# EasyEDA Pro project coildriver.eprj, board PCB2
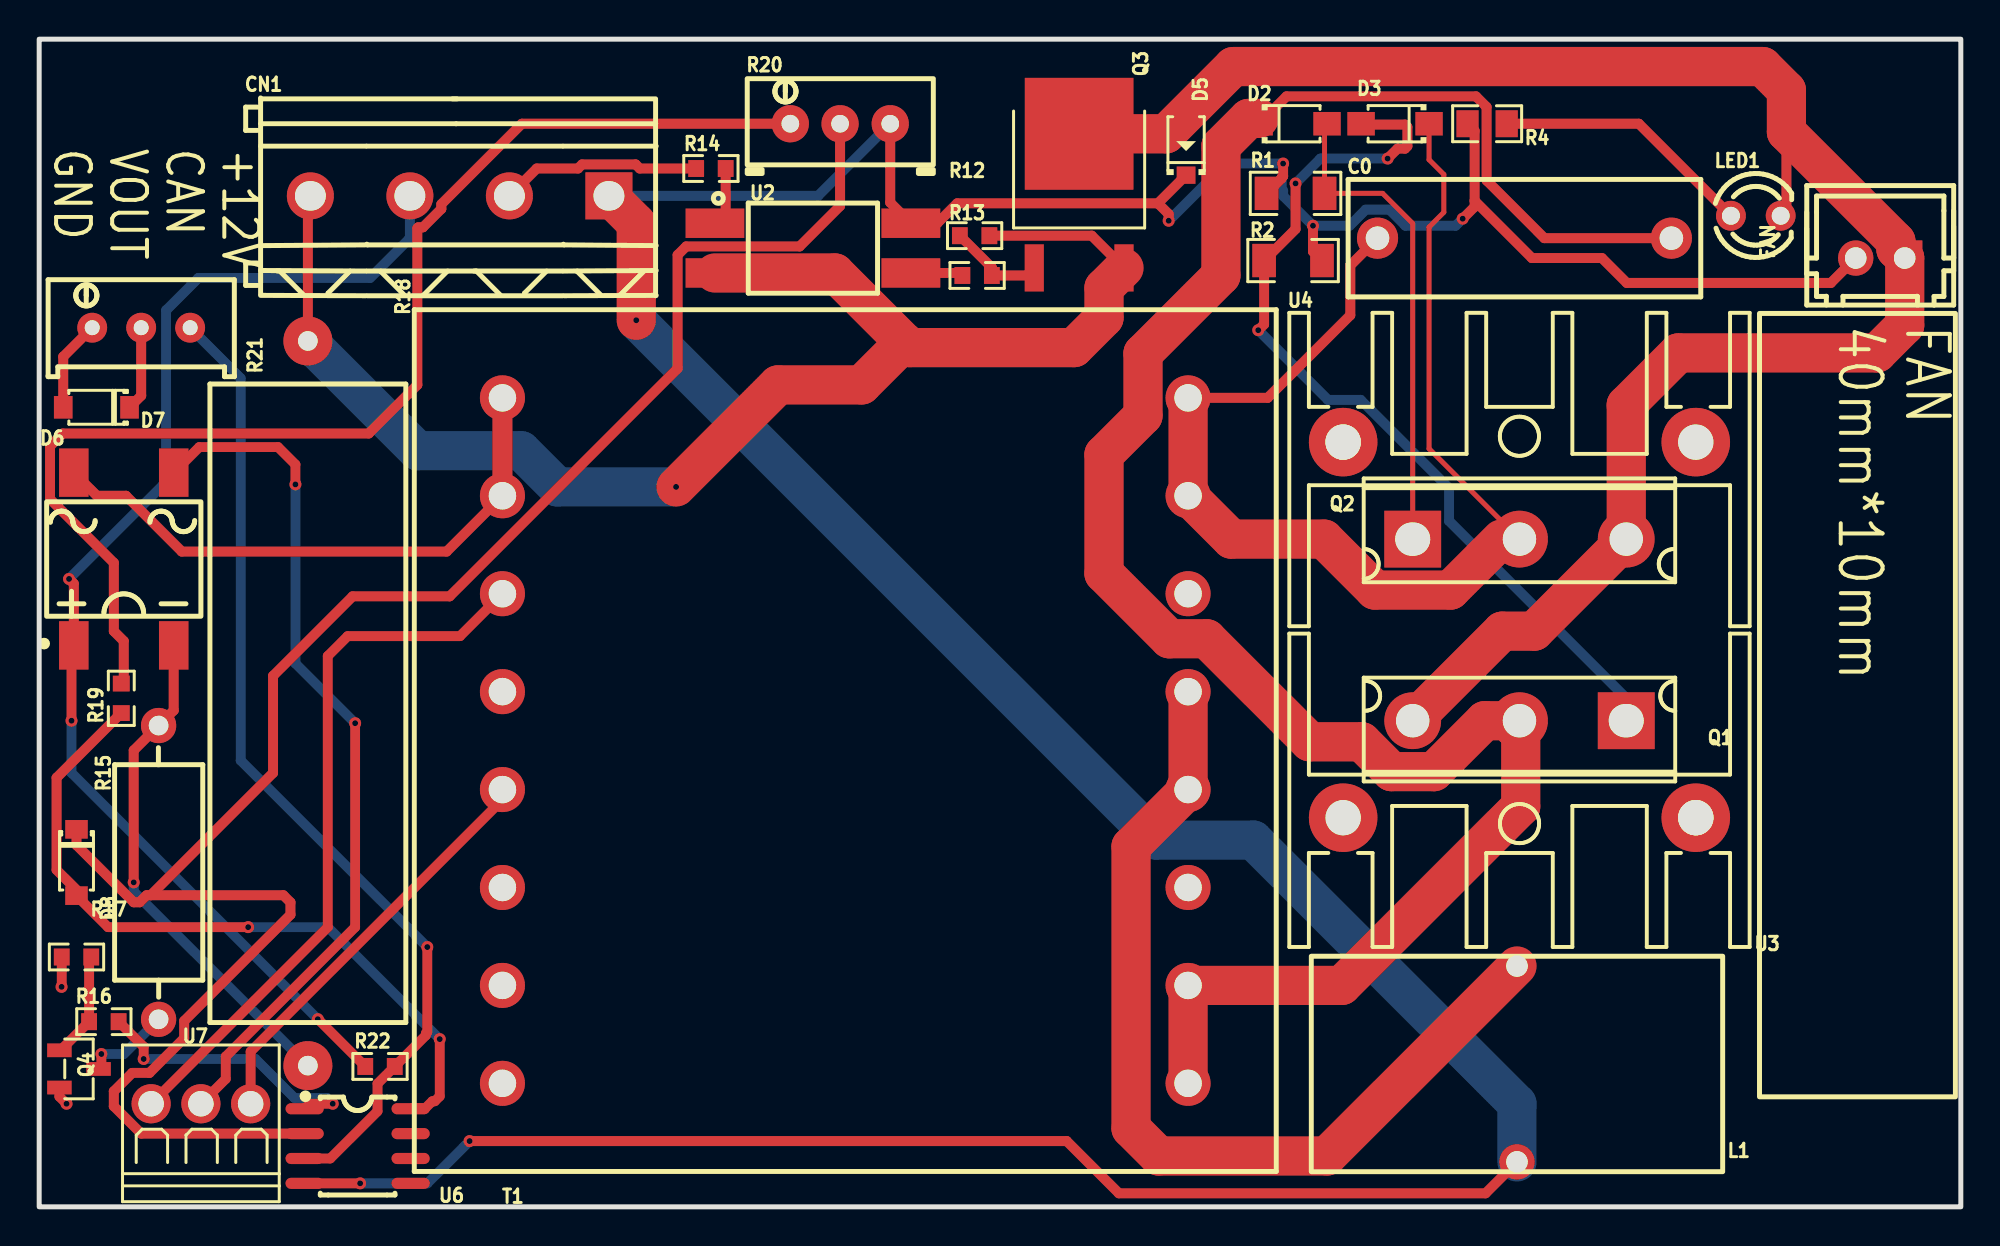
[diagram p4: board, top side]
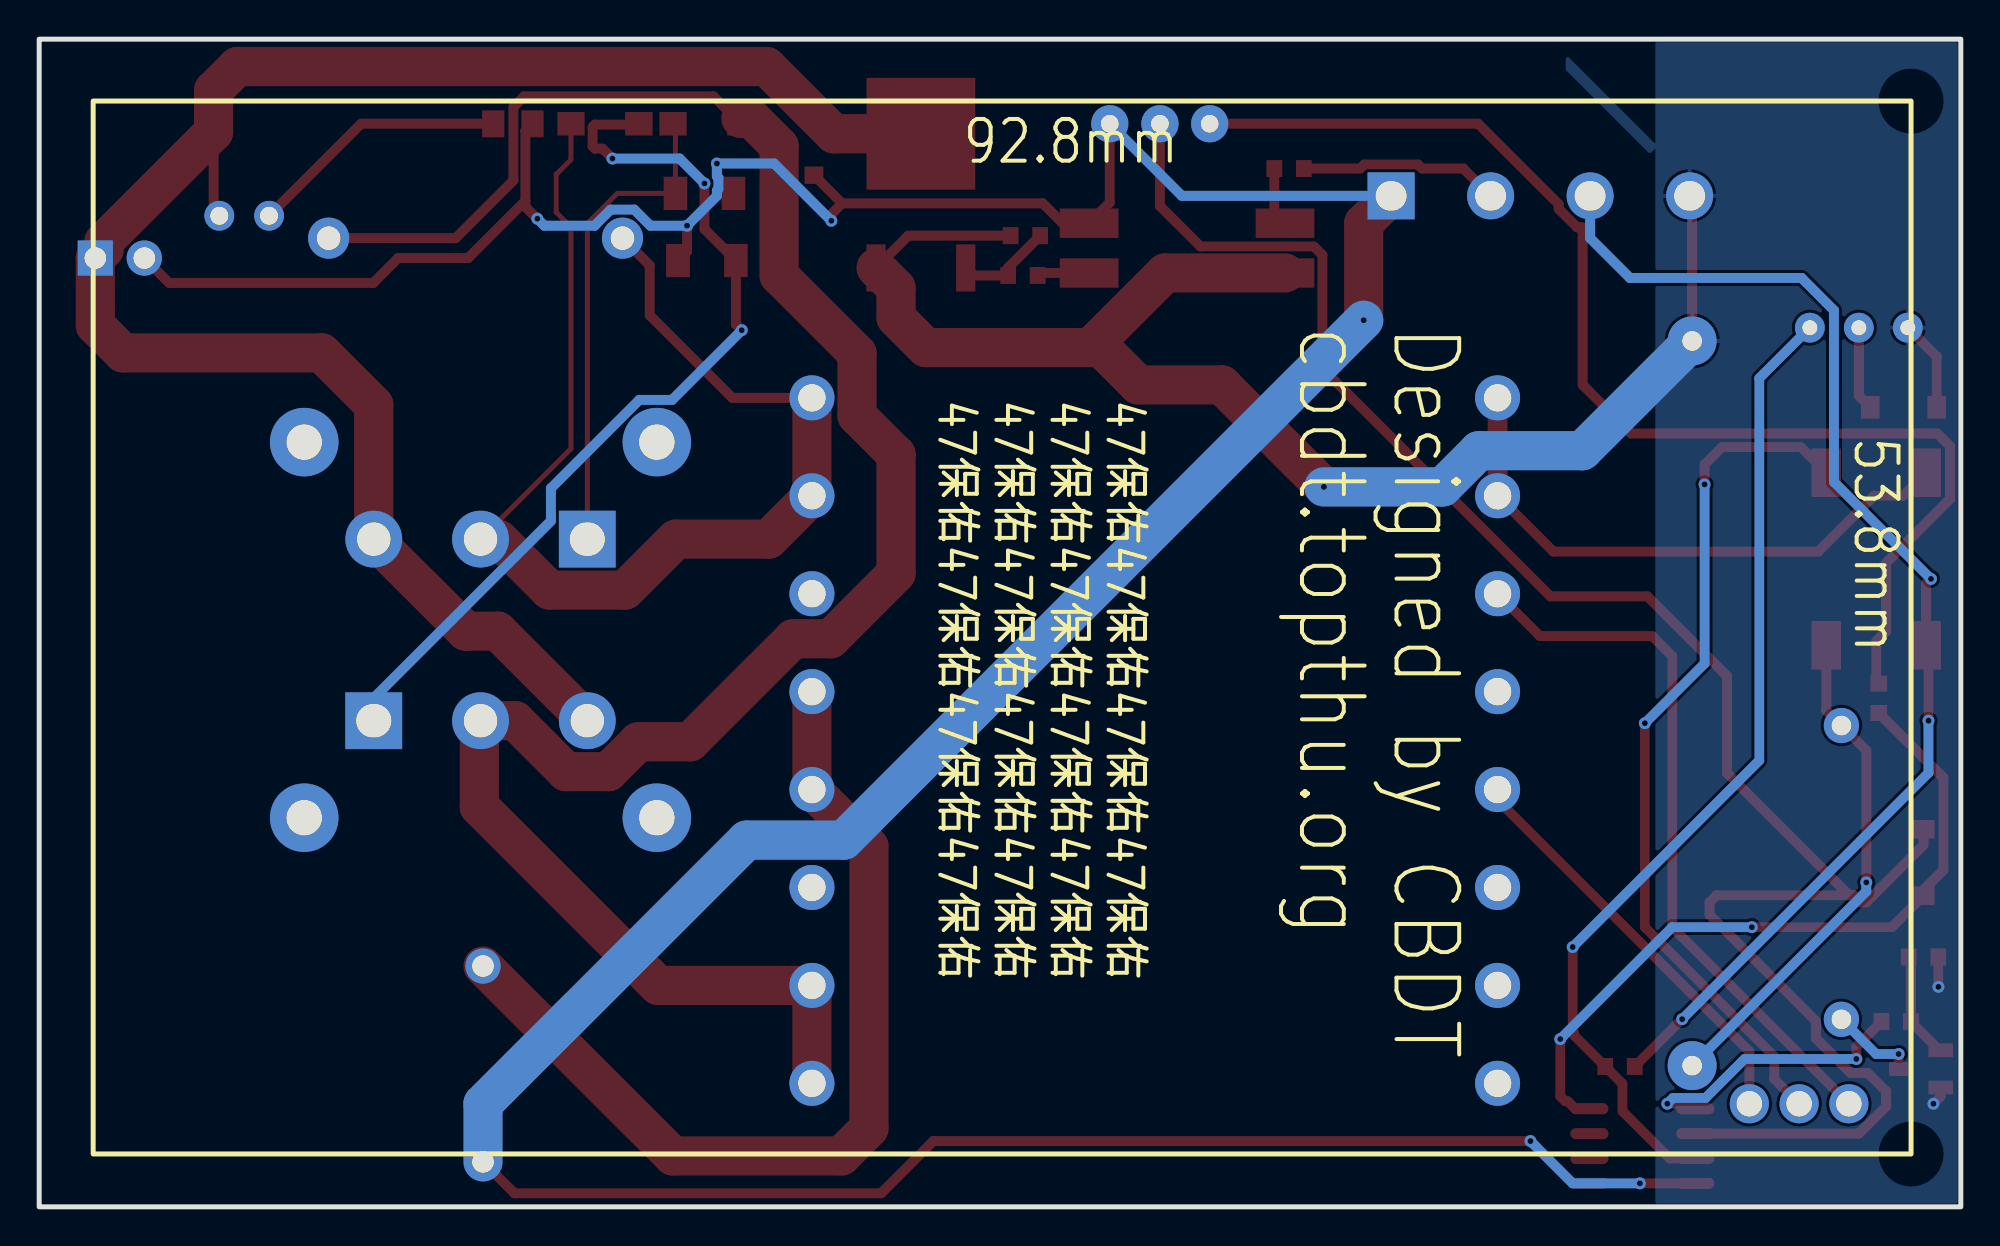
[diagram p5: board, bottom side, seen from below]

Outline 98.09 x 59.62 mm; copper layers: Top Layer, Bottom Layer. Coordinates in mm from the lower left corner of the outline.
Outline path: rectangle 0,59.62 98.09,0
Stack: Top Layer 0.035mm / Dielectric1 1.51mm FR4 er 4.5 / Bottom Layer 0.035mm

## Design rules (mm)
template: 自定义配置
spacing copperThickness1oz (default): track to track 0.102, other pairs 0.152 to 0.3
spacing copperThickness2oz: track to track 0.203, other pairs 0.152 to 0.3
track width copperThickness1oz (default): min 0.127, default 2, max 2.54
track width copperThickness2oz: min 0.203, default 0.254, max 2.54
differential pair differentialPair (default): width min 0.127, default 0.254, max 2.54; gap min 0.152, default 0.152
via viaSize (default): diameter min 0.5, default 0.61, max 10; hole min 0.3, default 0.305, max 6.3

## Placement (name value [footprint] x y rotation side)
C0  330nF  [CAP-TH_L18.0-W6.0-P15.00-D0.8]  75.82 49.46 0 top
CN1  DB128L-5.08-4P-GN-S  [CONN-TH_4P_DB128L-5.08-4P-GN-S]  21.46 51.62 0 top
D2  FR107  [SOD-123FL_L2.7-W1.8-LS3.8-RD]  64.01 55.3 0 top
D3  FR107  [SOD-123FL_L2.7-W1.8-LS3.8-RD]  69.22 55.3 180 top
D5  1N4148W  [SOD-123_L2.7-W1.6-LS3.7-FD]  58.55 54.29 270 top
D6  DB107S  [DBS_L8.2-W6.4-P5.10-LS10.0-BL]  4.32 33.08 0 top
D7  MM1Z5V1  [SOD-123_L2.8-W1.8-LS3.7-RD]  2.92 40.82 180 top
D8  MM1Z5V1  [SOD-123_L2.8-W1.8-LS3.7-RD]  1.91 17.58 270 top
FAN  ZX-XH2.54-2PZZ  [CONN-TH_2P-P2.50_HX25003-2A]  93.98 48.44 180 top
L1  68uH  [IND-TH_L21.0-W11.0-P10.00]  75.44 7.3 90 top
LED1  MV7442/QT264-7UGC  [LED-TH_BD3.0-P2.54-FD]  87.63 50.6 0 top
Q1  IRFP250NPBF  [TO-247AC-3_L15.8-W5.0-P5.46-L]  75.56 24.82 180 top
Q2  IRFP250NPBF  [TO-247AC-3_L15.8-W5.0-P5.46-L]  75.56 34.09 0 top
Q3  LR7843-VB  [TO-252-2_L6.6-W6.1-P4.58-LS9.9-BR]  53.09 51.36 270 top
Q4  AO3400A  [SOT-23-3_L2.9-W1.3-P1.90-LS2.4-BR]  2.03 7.04 180 top
R1  470Ω  [R1206]  64.13 51.75 0 top
R2  470Ω  [R1206]  64.01 48.32 180 top
R4  400Ω  [R0805]  73.91 55.3 180 top
R12  1kΩ  [R0603]  47.88 47.55 0 top
R13  10kΩ  [R0603]  47.75 49.59 180 top
R14  1kΩ  [R0603]  34.29 53.02 0 top
R15  20Ω  [RES-TH_BD4.5-L11.0-P15.00-D0.7]  6.1 17.07 90 top
R16  1kΩ  [R0603]  3.3 9.45 180 top
R17  10kΩ  [R0603]  1.91 12.76 0 top
R18  500Ω  [RES-TH_BD9.0-L31.5-P35.50-D0.8]  13.72 25.71 270 top
R19  47kΩ  [R0603]  4.19 25.96 90 top
R20  100kΩ  [RES-ADJ-TH_3P-L9.5-W4.9-P2.50-L_3296W]  40.89 55.3 0 top
R21  20kΩ  [RES-ADJ-TH_3P-L10.0-W10.0-P2.50-BL-BS]  5.21 44.89 90 top
R22  100kΩ  [R0603]  17.4 7.17 180 top
T1  EC49  [XFMR-TH_16P-L40.0-W40.0-P5.00-LS35.0-BL]  41.15 23.81 90 top
U2  PC817X1NIP0F  [OPTO-SMD-4_L4.6-W6.5-P2.54-LS10.3-BL]  39.5 48.95 270 top
U3  23.5*16*25  [HEATSINK-TH_L23.5-W16.0-P18.0_XSD2156-067]  75.56 19.87 180 top
U4  23.5*16*25  [HEATSINK-TH_L23.5-W16.0-P18.0_XSD2156-067]  75.56 39.05 0 top
U6  OPA2277UA/2K5  [SOIC-8_L5.0-W4.0-P1.27-LS6.0-BL]  16.26 3.1 270 top
U7  2.54-3P接线端子  [CONN-TH_2.54-3P]  8.25 5.26 0 top

## Footprints (pads in the part's own frame, mm; a bottom-side part is the same pattern mirrored in y, then rotated)
CAP-TH_L18.0-W6.0-P15.00-D0.8
  round 2.1 hole 1.2: 1(-7.5,0) 2(7.5,0)
CONN-TH_2.54-3P
  round 2 hole 1.3: 1(-2.54,0) 2(0,0) 3(2.54,0)
CONN-TH_2P-P2.50_HX25003-2A
  rect 1.8x1.8 hole 1.1: 1(-1.25,0)
  round 1.8 hole 1.1: 2(1.25,0)
CONN-TH_4P_DB128L-5.08-4P-GN-S
  rect 2.4x2.4 hole 1.575x1.5: 1(7.62,0)
  round 2.4 hole 1.575x1.5: 2(2.54,0) 3(-2.54,0) 4(-7.62,0)
DBS_L8.2-W6.4-P5.10-LS10.0-BL
  rect 1.505x2.47 smd: 1(-2.55,-4.41) 2(2.55,-4.41) 3(2.55,4.41) 4(-2.55,4.41)
HEATSINK-TH_L23.5-W16.0-P18.0_XSD2156-067
  round 3.5 hole 1.8: 1(-9,0) 2(9,0)
IND-TH_L21.0-W11.0-P10.00
  round 1.8 hole 1.1: 1(-5,0) 2(5,0)
LED-TH_BD3.0-P2.54-FD
  round 1.524 hole 0.914: 1(-1.27,0) 2(1.27,0)
OPTO-SMD-4_L4.6-W6.5-P2.54-LS10.3-BL
  rect 1.5x3 smd: 1(-1.27,-5) 2(1.27,-5) 3(1.27,5) 4(-1.27,5)
R0603
  rect 0.806x0.864 smd: 1(-0.753,0) 2(0.753,0)
R0805
  rect 1.133x1.377 smd: 1(-1,0) 2(1,0)
R1206
  rect 1.208x1.701 smd: 1(-1.479,0) 2(1.479,0)
RES-ADJ-TH_3P-L9.5-W4.9-P2.50-L_3296W
  round 1.9 hole 0.9: 1(-2.55,0) 2(-0.01,0) 3(2.55,0)
RES-ADJ-TH_3P-L10.0-W10.0-P2.50-BL-BS
  round 1.524 hole 0.762: 1(0,2.5) 2(0,0) 3(0,-2.5)
RES-TH_BD4.5-L11.0-P15.00-D0.7
  round 1.8 hole 1: 1(-7.5,0) 2(7.5,0)
RES-TH_BD9.0-L31.5-P35.50-D0.8
  round 2.5 hole 1: 1(-18.5,0) 2(18.5,0)
SOD-123_L2.7-W1.6-LS3.7-FD
  rect 0.88x0.96 smd: 1(-1.61,0) 2(1.61,0)
SOD-123_L2.8-W1.8-LS3.7-RD
  rect 0.95x1.15 smd: 1(-1.692,0) 2(1.692,0)
SOD-123FL_L2.7-W1.8-LS3.8-RD
  rect 1.4x1.2 smd: 1(-1.735,0) 2(1.735,0)
SOIC-8_L5.0-W4.0-P1.27-LS6.0-BL
  oval 0.569x1.95 smd: 1(-1.905,-2.705) 2(-0.635,-2.705) 3(0.635,-2.705) 4(1.905,-2.705) 5(1.905,2.705) 6(0.635,2.705) 7(-0.635,2.705) 8(-1.905,2.705)
SOT-23-3_L2.9-W1.3-P1.90-LS2.4-BR
  rect 1.25x0.7 smd: 1(1,-0.95) 2(1,0.95) 3(-1,0)
TO-247AC-3_L15.8-W5.0-P5.46-L
  rect 2.9x2.9 hole 1.785x1.7: 1(-5.45,0)
  round 2.9 hole 1.7: 2(0,0) 3(5.45,0)
TO-252-2_L6.6-W6.1-P4.58-LS9.9-BR
  rect 2.409x0.979 smd: 1(3.424,-2.29) 3(3.424,2.29)
  rect 5.711x5.548 smd: 2(-3.424,0)
XFMR-TH_16P-L40.0-W40.0-P5.00-LS35.0-BL
  round 2.3 hole 1.4: 1(-17.5,-17.5) 2(-12.5,-17.5) 3(-7.5,-17.5) 4(-2.5,-17.5) 5(2.5,-17.5) 6(7.5,-17.5) 7(12.5,-17.5) 8(17.5,-17.5) 9(17.5,17.5) 10(12.5,17.5) 11(7.5,17.5) 12(2.5,17.5) 13(-2.5,17.5) 14(-7.5,17.5) 15(-12.5,17.5) 16(-17.5,17.5)

## Nets
As in the schematic.

Pads without a net: T1 3 6 12 14 15 16; U3 1 2; U4 1 2; U6 5 6 7

## Via types
v1: diameter 0.61, hole 0.305, Top Layer to Bottom Layer, 25 vias

## Routing (per net, layer and track width the routed paths; a pad name or vN(x,y) marks a point on that pad's centre or on a via; arc(x,y) is an arc through that point)
12V: length 223.8
  Top Layer w0.508: R4.2 73.28,54.94 73.28,51.37 ; R20.3 43.44,51.27 U2.4 45.85,50.22 46.86,51.24 57.11,51.24 ; v1(65.02,50.09) 65.02,48.78 R2.1 ; v1(63.5,53.27) 63.5,52.62 63.42,52.55 63.42,52.51 62.66,51.75 ; 57.11,51.24 57.66,50.69 v1(57.66,50.35) ; 57.11,51.24 D5.2 ; L1.1 73.83,0.69 55.12,0.69 52.45,3.36 v1(21.97,3.36) ; v1(72.67,50.45) 73.28,51.06 73.28,51.37 ; 73.28,51.37 76.2,48.44 79.77,48.44 81.04,47.17 91.46,47.17 FAN.2 ; U6.4 v1(16.38,1.2)
  Top Layer w1.999: v1(30.48,45.27) 30.48,50.22 CN1.1
  Bottom Layer w0.508: v1(72.67,50.45) 72.31,50.09 69.74,50.09 68.92,50.92 67.72,50.92 66.9,50.09 v1(65.02,50.09) 63.5,51.62 63.5,51.88 63.42,51.96 63.42,52.55 63.5,52.62 v1(63.5,53.27) 60.58,53.27 v1(57.66,50.35) ; v1(16.38,1.2) 19.81,1.2 v1(21.97,3.36) ; CN1.1 39.76,51.62 R20.3
  Bottom Layer w1.999: L1.1 75.44,5.26 61.98,18.73 57.02,18.73 v1(30.48,45.27)
GND: length 83.8
  Top Layer w0.5: v1(1.4,5.26) 1.03,5.63 Q4.2 ; v1(1.14,11.23) 1.15,11.24 R17.1
  Top Layer w0.508: R13.1 53.73,49.59 Q3.3 ; D7.2 1.23,43.41 R21.1 ; CN1.4 13.72,51.49 R18.1
  Top Layer w1.999: 44.16,44.14 40.62,47.68 U2.2 ; 44.16,44.14 41.98,41.97 37.72,41.97 v1(32.51,36.76) ; 44.16,44.14 44.43,43.87 52.83,43.87 54.36,45.4 54.36,46.92 Q3.3
  Bottom Layer w1.999: v1(32.51,36.76) 26.45,36.76 24.6,38.61 19.32,38.61 R18.1
GNDOUT: length 26
  Top Layer w0.508: v1(4.83,16.57) 4.83,23.3 R15.2 6.87,25.35 D6.2
  Bottom Layer w0.508: R18.2 4.83,16.1 v1(4.83,16.57)
ZVS_CTRL: length 10.3
  Top Layer w0.508: CN1.2 25.4,53.02 27.51,53.02 27.72,53.22 30.45,53.22 30.66,53.02 R14.1
ZVS_GND: length 94.4
  Top Layer w0.508: LED1.2 89.19,50.89 89.19,54.88
  Top Layer w1.999: Q3.2 57.53,54.79 60.96,58.22 87.98,58.22 89.19,57.01 89.19,54.88 94.78,49.29 94.78,48.89 FAN.1 95.23,45.01 93.82,43.6 83.68,43.6 81.01,40.94 Q2.3 76.32,29.39 74.69,29.39 Q1.3
ZVS_OUT: length 63.2
  Top Layer w0.5: v1(1.65,24.82) 1.65,28.55 D6.1 ; v1(14.22,9.58) 14.23,9.58 R22.2
  Top Layer w0.508: D6.1 1.77,31.82 v1(1.52,32.06)
  Bottom Layer w0.5: v1(1.65,24.82) 1.65,22.15 v1(14.22,9.58)
  Bottom Layer w0.508: CN1.3 18.92,49.46 16.89,47.43 8.13,47.43 6.48,45.78 6.48,37.01 v1(1.52,32.06)
$1N2002: length 110.3
  Top Layer w0.508: D2.1 63.67,56.7 73.35,56.7 73.89,56.16 73.89,52.41 76.84,49.46 C0.2
  Top Layer w1.999: T1.1 T1.2 66.49,11.31 75.63,20.44 75.63,24.76 Q1.2 73.79,24.82 71.19,22.22 69.04,22.22 67.51,23.74 64.86,23.74 59.6,29 57.69,29 54.36,32.34 54.36,38.41 56.35,40.4 56.35,43.58 60.32,47.55 60.32,54.16 61.74,55.57 62.27,55.57
$1N2003: length 62.2
  Top Layer w0.254: 75.31,34.35 70.95,38.71 70.95,50.03 71.7,50.78 71.7,52.71 70.95,53.46 70.95,55.3
  Top Layer w0.508: T1.8 62.71,41.31 66.93,45.52 66.93,48.07 C0.1
  Top Layer w1.999: Q2.2 75.31,34.09 ; 74.64,34.09 72.04,31.49 68.19,31.49 65.59,34.09 60.86,34.09 T1.7 T1.8
$1N2004: length 24.9
  Top Layer w0.254: Q2.1 70.12,50.21 68.58,51.75 R1.2 65.61,55.17 D2.2
$1N2005: length 46.9
  Top Layer w0.508: v1(62.23,44.76) 62.53,45.06 R2.2 64.13,49.92 v1(64.13,52.25) ; D3.2 67.52,55.26 69.72,55.26 69.84,55.14 69.84,54.15 69.72,54.03 69.34,54.03 v1(68.83,53.52)
  Bottom Layer w0.508: Q1.1 81.01,25.98 71.97,35.02 71.97,36.69 67.46,41.2 65.79,41.2 v1(62.23,44.76) ; v1(64.13,52.25) 65.41,53.52 v1(68.83,53.52)
$1N2006: length 47.8
  Top Layer w1.999: T1.5 T1.4 55.74,18.39 55.74,4.01 57.15,2.6 65.74,2.6 L1.2
$1N2007: length 13.4
  Top Layer w0.508: 86.36,50.6 81.66,55.3 R4.1
$1N2014: length 36.8
  Top Layer w0.5: T1.11 21.48,29.14 15.75,29.14 14.73,28.12 14.73,14.28 U7.1
$1N2019: length 2.7
  Top Layer w0.508: U2.3 47,47.68 R12.1
$1N2020: length 5
  Top Layer w0.508: Q3.1 50.41,47.55 R12.2 48.63,47.95 R13.2
$1N2022: length 3
  Top Layer w0.508: R14.2 35.04,50.77 U2.1
$1N5388: length 4.5
  Top Layer w0.5: v1(3.17,7.8) 3.17,7.18 Q4.3
  Bottom Layer w0.5: R15.1 4.33,7.8 v1(3.17,7.8)
$1N5546: length 14.6
  Top Layer w0.5: U6.1 13.81,5.26 v1(14.99,5.26) ; R16.1 5.33,8.18 v1(5.33,7.55)
  Bottom Layer w0.5: v1(5.33,7.55) 11.04,7.55 13.03,5.56 14.69,5.56 v1(14.99,5.26)
$1N5550: length 5.5
  Top Layer w0.5: 1.03,7.99 1.09,7.99 R16.2
  Top Layer w0.508: R17.2 2.55,12.65 R16.2
$1N5594: length 29.7
  Top Layer w0.508: T1.10 20.8,33.46 7.28,33.46 4.43,36.31 2.95,36.31 D6.4
  Top Layer w1.016: T1.9 T1.10
$1N5608: length 44.3
  Top Layer w0.5: v1(13.08,36.89) 13.08,37.9 12.19,38.79 8.17,38.79 D6.3 ; v1(16.13,24.69) 16.13,14.28 9.53,7.68 9.53,6.53 U7.2
  Bottom Layer w0.5: v1(16.13,24.69) 13.08,27.74 v1(13.08,36.89)
$1N6234: length 37.4
  Top Layer w0.5: v1(10.67,14.28) 3.51,14.28 D8.2 ; v1(20.45,8.56) 20.45,5.64 20.19,5.39 20.07,5.39 19.69,5.01 U6.8
  Top Layer w0.508: 2.16,15.93 0.89,17.2 0.89,21.91 R19.1
  Bottom Layer w0.5: v1(20.45,8.56) 14.73,14.28 v1(10.67,14.28)
$1N6240: length 63.2
  Top Layer w0.508: R19.2 4.32,26.84 4.32,28.89 3.81,29.39 3.81,32.88 0.55,36.14 0.55,38.83 1.21,39.49 16.82,39.49 19.3,41.97 19.3,49.97 19.35,50.01 19.59,50.01 20.53,50.95 20.53,51.19 24.64,55.3 R20.1
$1N6394: length 98.5
  Top Layer w0.508: D8.1 1.91,18.47 4.83,15.55 5.12,15.55 5.48,15.91 5.69,15.91 ; R20.2 40.88,51.1 38.82,49.04 33.03,49.04 32.59,48.6 32.59,42.81 20.95,31.17 16,31.17 11.94,27.11 11.94,22.15 5.69,15.91 ; U6.2 5.21,3.74 3.81,5.14 3.81,5.9 4.75,6.84 5.63,6.84 7.4,8.61 7.4,9.49 12.83,14.92 12.83,15.55 12.47,15.91 5.69,15.91
$1N7515: length 4.3
  Top Layer w0.508: D7.1 5.21,41.42 R21.2
$1N7525: length 50.8
  Top Layer w0.5: U6.3 14.86,2.47 17.27,4.88 17.27,6.29 R22.1 19.74,8.76 19.74,8.86 19.81,8.93 v1(19.81,13.26)
  Bottom Layer w0.5: R21.3 10.29,42.31 10.29,22.79 v1(19.81,13.26)
$1N8658: length 21.4
  Top Layer w0.5: T1.13 23.65,20.78 10.8,7.93 U7.3

## Copper pours and planes (outline as drawn; the poured copper is in the pictures)
GND on Bottom Layer: 15.62,54.16 15.88,53.9 20.07,58.1 20.07,58.6
GND on Bottom Layer: 15.49,54.03 15.49,-1.34 10.92,-5.91 -3.3,-5.91 -4.7,-4.52 -4.7,59.87 2.54,67.11 5.33,64.32 15.49,64.32 15.49,54.29 15.62,54.16

## Text on the board
Bottom Silkscreen Layer: 92.8mm | 53.8mm | Designed by CBDT | cbdt.topthu.org | 47保佑47保佑47保佑47保佑 / 47保佑47保佑47保佑47保佑 / 47保佑47保佑47保佑47保佑 / 47保佑47保佑47保佑47保佑
Top Silkscreen Layer: +12V / CAN / VOUT / GND | FAN / 40mm*10mm
